# EAGLE schematic sound-op-switch (EAGLE 6.6.0)
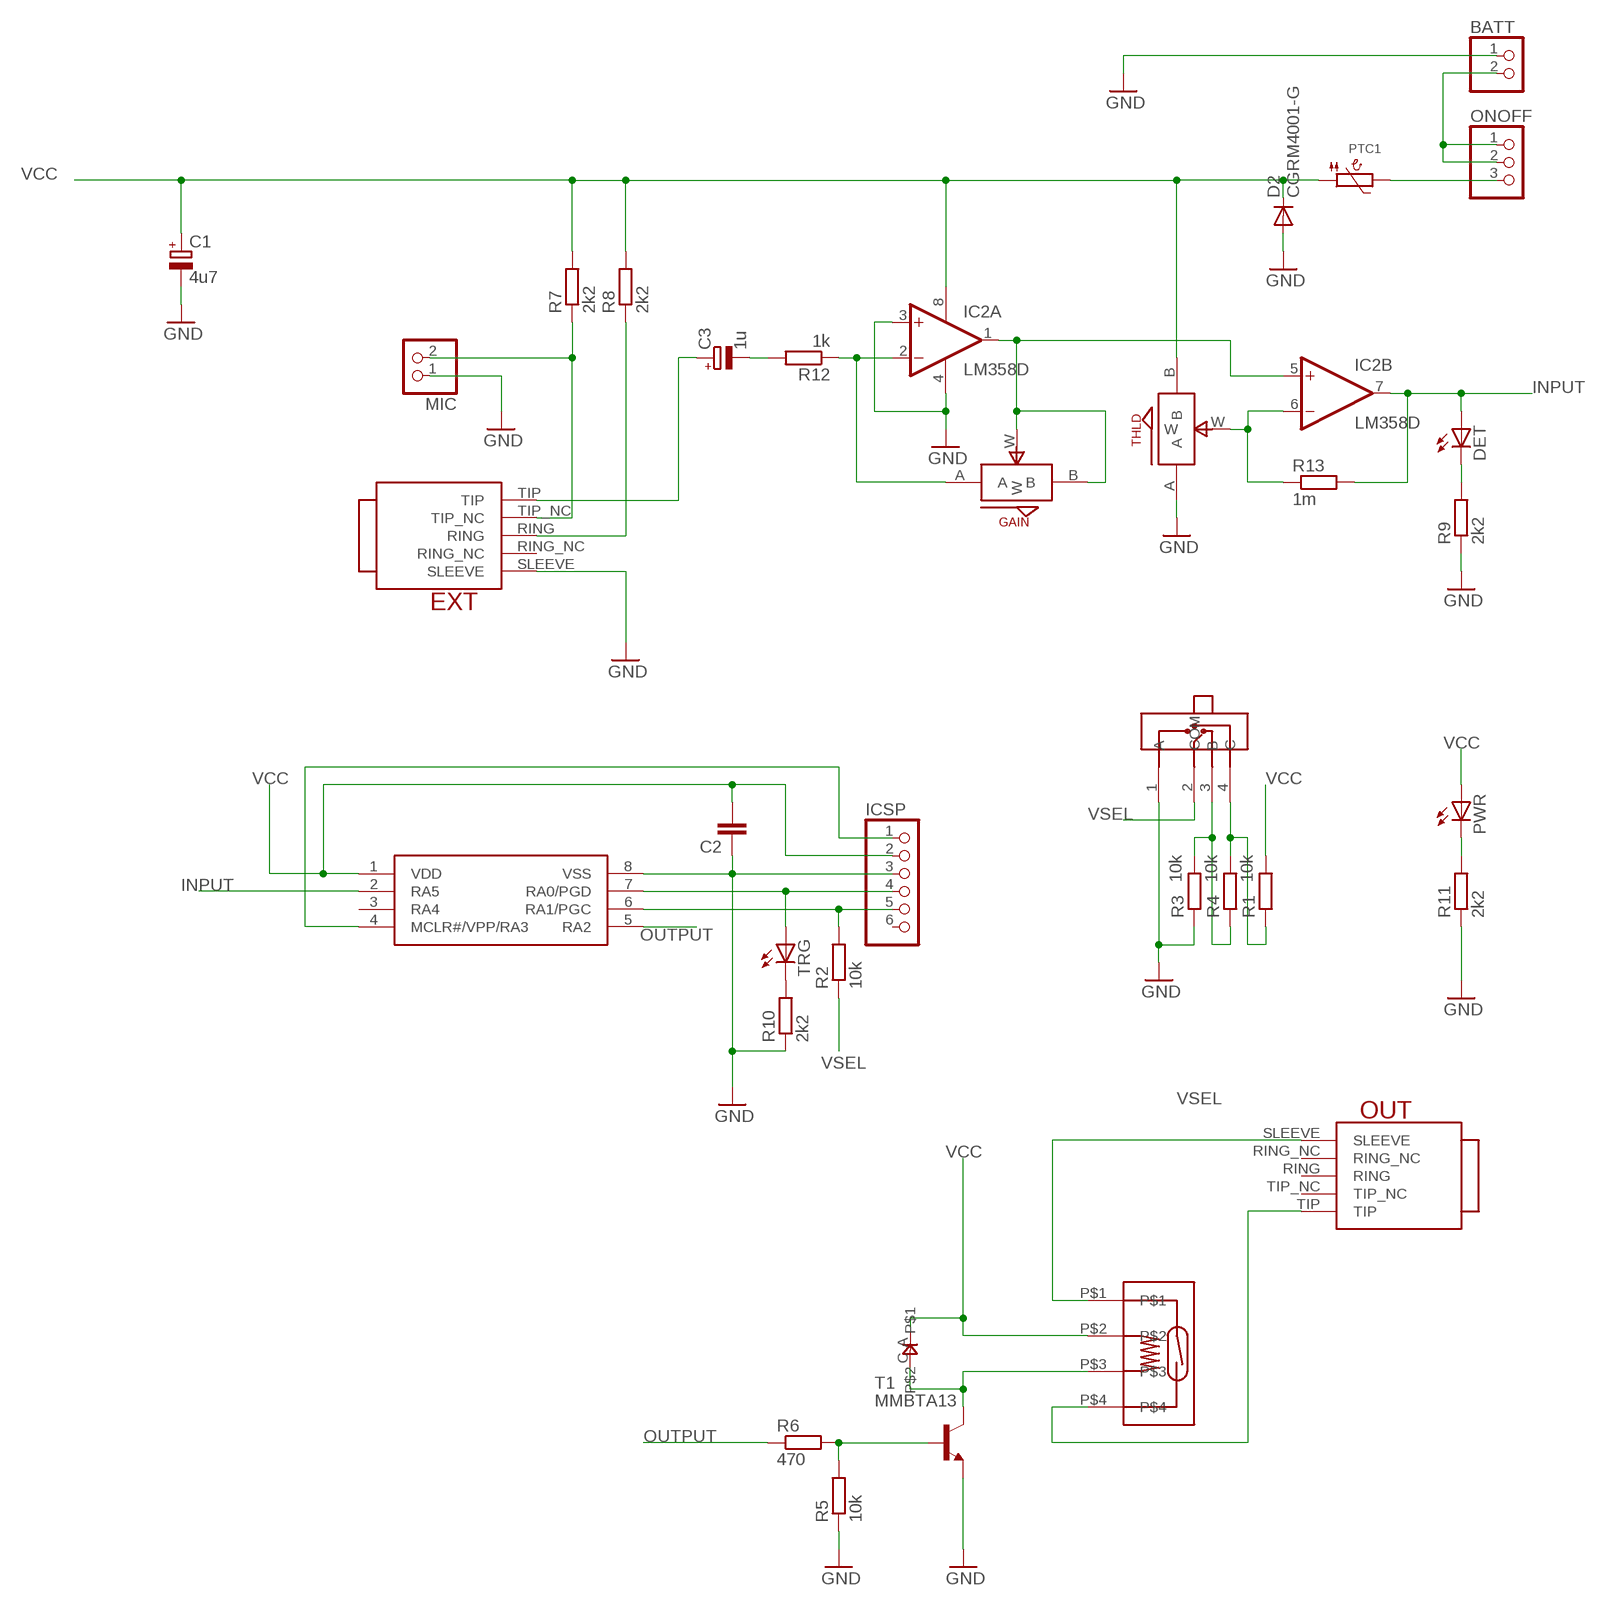
[diagram p0: schematic, sheet 1]

## Parts
BATT  PINHD-1X2  [1X02]
C1  4u7  CPOL-EUE2,5-6E  [E2,5-6E]
C2  C-EUC0805  [C0805]
C3  1u  CPOL-EUE2,5-6E  [E2,5-6E]
D1  0805DIODE  [0805DIODE]
D2  CGRM4001-G  [SOD-123_MINI-SMA]
DET  LED3MM  [LED3MM]
EXT  TRUCONNECTJACK  [TRUCONNECTJACK]
GAIN  ALPS_POT_SMALL  [SMALL_ALPS_POT]
IC1  PIC12F1822  [DIL08]
IC2  LM358D  [SO08]
ICSP  PINHD-1X6  [1X06]
MIC  PINHD-1X2  [1X02]
MODE  SP4T-SLIDE  [SP3T-SLIDE]
ONOFF  PINHD-1X3  [1X03]
OUT  TRUCONNECTJACK  [TRUCONNECTJACK]
PTC1  PTC1206  [1206]
PWR  LED3MM  [LED3MM]
R1  10k  R-EU_R0805  [R0805]
R2  10k  R-EU_R0805  [R0805]
R3  10k  R-EU_R0805  [R0805]
R4  10k  R-EU_R0805  [R0805]
R5  10k  R-EU_R0805  [R0805]
R6  470  R-EU_R0805  [R0805]
R7  2k2  R-EU_R0805  [R0805]
R8  2k2  R-EU_R0805  [R0805]
R9  2k2  R-EU_R0805  [R0805]
R10  2k2  R-EU_R0805  [R0805]
R11  2k2  R-EU_R0805  [R0805]
R12  1k  R-EU_R0805  [R0805]
R13  1m  R-EU_R0805  [R0805]
RLY1  9007-REED-RELAY  [9007-REED-RELAY]
T1  MMBTA13  MMBT3904LT1-NPN-SOT23-BEC  [SOT23-BEC]
THLD  ALPS_POT_SMALL  [SMALL_ALPS_POT]
TRG  LED3MM  [LED3MM]

## Nets
GND: BATT.1 C1.- C2.1 D2.A EXT.SLEEVE IC1.8(VSS) IC2.3(A:+IN) IC2.4(P:V-) ICSP.3 MIC.1 MODE.1(A) R3.1 R5.1 R9.1 R10.1 R11.1 T1.E THLD.A
INPUT: DET.A IC1.2(RA5) IC2.7(B:OUT) R13.2
N$1: EXT.TIP_NC MIC.2 R7.1
N$2: C3.- R12.2
N$3: GAIN.A IC2.2(A:-IN) R12.1
N$4: DET.K(C) R9.2
N$5: EXT.RING R8.1
N$6: IC1.7(RA0/PGD) ICSP.4 TRG.A
N$7: GAIN.B GAIN.W IC2.1(A:OUT) IC2.5(B:+IN)
N$8: MODE.4(C) R1.1 R4.2
N$9: IC1.6(RA1/PGC) ICSP.5 R2.2
N$10: R5.2 R6.2 T1.B
N$11: IC1.4(MCLR#/VPP/RA3) ICSP.1
N$12: C3.+ EXT.TIP
N$13: IC2.6(B:-IN) R13.1 THLD.W
N$14: MODE.3(B) R3.2 R4.1
N$15: D1.C RLY1.P$3 T1.C
N$16: PWR.K(C) R11.2
N$17: R10.2 TRG.K(C)
N$18: BATT.2 ONOFF.1 ONOFF.2
N$19: ONOFF.3 PTC1.2
N$27: OUT.SLEEVE RLY1.P$1
N$28: OUT.TIP RLY1.P$4
OUTPUT: IC1.5(RA2) R6.1
VCC: C1.+ C2.2 D1.A D2.C IC1.1(VDD) IC2.8(P:V+) ICSP.2 PTC1.1 PWR.A R1.2 R7.2 R8.2 RLY1.P$2 THLD.B
VSEL: MODE.2(COM) R2.1
Unconnected: EXT.RING_NC IC1.3(RA4) ICSP.6 OUT.RING OUT.RING_NC OUT.TIP_NC

## Library data of the parts
BATT MIC = pinhead:PINHD-1X2: PIN HEADER
C1 C3 = rcl:CPOL-EU: POLARIZED CAPACITOR, European symbol
C2 = resistor:C-EU: CAPACITOR, European symbol
D1 = jasons_stuff:0805DIODE
D2 = diode:CGRM400*-G: Molded plasitc,JEDEC SOD-123/Mini SMA Source: Comchip CGRM4001-G.pdf
DET PWR TRG = led:LED: LED OSRAM: - CHIPLED LG R971, LG N971, LY N971, LG Q971, LY Q971, LO R971, LY R971 LH N974, LH R974 LS Q976, LO Q976, LY Q976 LO Q996 - Hyper CHIPLED LW Q18S LB Q993, LB Q99A, LB R99A - SideLED LS A670, LO A670, LY A670, LG A670, LP A670 LB A673, LV A673, LT A673, LW A673 LH A674 LY A675 LS A676, LA A676, LO A676, LY A676, LW A676 LS A679, LY A679, LG A679 - Hyper Micro SIDELED® LS Y876, LA Y876, LO Y876, LY Y876 LT Y87S - SmartLED LW L88C, LW L88S LB L89C, LB L89S, LG L890 LS L89K, LO L89K, LY L89K LS L896, LA L896, LO L896, LY L896 - TOPLED LS T670, LO T670, LY T670, LG T670, LP T670 LSG T670, LSP T670, LSY T670, LOP T670, LYG T670 LG T671, LOG T671, LSG T671 LB T673, LV T673, LT T673, LW T673 LH T674 LS T676, LA T676, LO T676, LY T676, LB T676, LH T676, LSB T676, LW T676 LB T67C, LV T67C, LT T67C, LS T67K, LO T67K, LY T67K, LW E67C LS E67B, LA E67B, LO E67B, LY E67B, LB E67C, LV E67C, LT E67C LW T67C LS T679, LY T679, LG T679 LS T770, LO T770, LY T770, LG T770, LP T770 LB T773, LV T773, LT T773, LW T773 LH T774 LS E675, LA E675, LY E675, LS T675 LS T776, LA T776, LO T776, LY T776, LB T776 LHGB T686 LT T68C, LB T68C - Hyper Mini TOPLED® LB M676 - Mini TOPLED Santana® LG M470 LS M47K, LO M47K, LY M47K Source: http://www.osram.convergy.de LUXEON: - LUMILED® LXK2-PW12-R00, LXK2-PW12-S00, LXK2-PW14-U00, LXK2-PW14-V00 LXK2-PM12-R00, LXK2-PM12-S00, LXK2-PM14-U00 LXK2-PE12-Q00, LXK2-PE12-R00, LXK2-PE12-S00, LXK2-PE14-T00, LXK2-PE14-U00 LXK2-PB12-K00, LXK2-PB12-L00, LXK2-PB12-M00, LXK2-PB14-N00, LXK2-PB14-P00, LXK2-PB14-Q00 LXK2-PR12-L00, LXK2-PR12-M00, LXK2-PR14-Q00, LXK2-PR14-R00 LXK2-PD12-Q00, LXK2-PD12-R00, LXK2-PD12-S00 LXK2-PH12-R00, LXK2-PH12-S00 LXK2-PL12-P00, LXK2-PL12-Q00, LXK2-PL12-R00 Source: www.luxeon.com KINGBRIGHT: KA-3528ASYC Source: www.kingbright.com
EXT OUT = jason_eagle6:TRUCONNECTJACK
GAIN THLD = jasons_stuff:ALPS_POT_SMALL
IC1 = jasons_stuff:PIC12F1822
IC2 = linear:LM358: OP AMP also LM158; LM258; LM2904 Source: http://cache.national.com/ds/LM/LM158.pdf
ICSP = pinhead:PINHD-1X6: PIN HEADER
MODE = jason_eagle6:SP4T-SLIDE
ONOFF = pinhead:PINHD-1X3: PIN HEADER
PTC1 = microbuilder:PTC: PTC (Resettable Fuse) 1206 Package 250mA PTC (16V Max, Time-to-Trip: 0.08s) - Digikey: F2110CT-ND 1210 Package 100mA PTC (30V Max, Time-to-Trip: 0.6s) - Digikey: MF-USMF010-2CT-ND 1812 Package 750mA PTC (24V Max, Time-to-Trip: 0.2s) - Digikey: MF-MSMF075/24-2CT-ND
R1-R11 R13 = resistor:R-EU_: RESISTOR, European symbol
R12 = rcl:R-EU_: RESISTOR, European symbol
RLY1 = jason_eagle6:9007-REED-RELAY
T1 = transistor-neu-to92:*-NPN-: NPN Transistror